# Altium schematic sheet Power.SchDoc
size A4
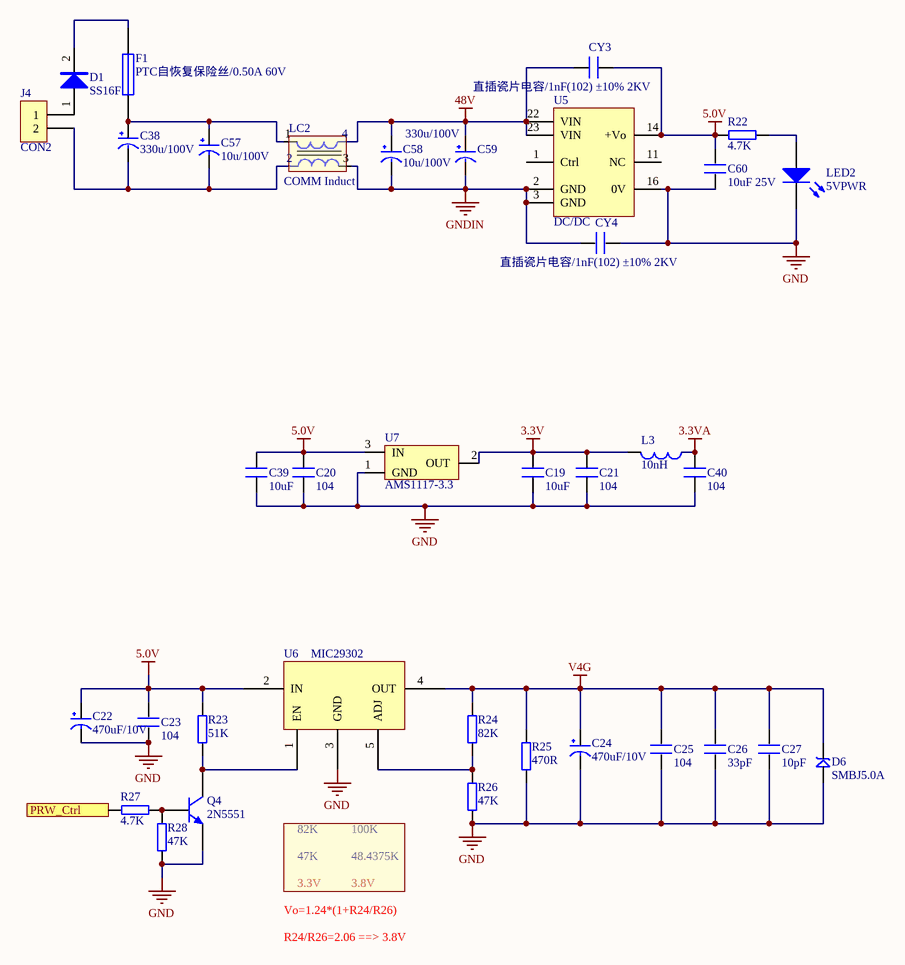
[diagram p0: Power.SchDoc]

## Parts
C19  10uF  [1206_C]
C20  104  [0603_C]
C21  104  [0603_C]
C22  470uF/10V  [SMD-CT-7343]
C23  104  [0603_C]
C24  470uF/10V  [SMD-CT-7343]
C25  104  [0603_C]
C26  33pF  [0603_C]
C27  10pF  [0603_C]
C38  330u/100V  [SMD-CT-7343]
C39  10uF  [1206_C]
C40  104  [0603_C]
C57  10u/100V  [SMD-CT-7343]
C58  10u/100V  [SMD-CT-7343]
C59  330u/100V  [SMD-CT-7343]
C60  10uF 25V  [1206_C]
CY3  直插瓷片电容/1nF(102) ±10% 2KV  [1206_C]
CY4  直插瓷片电容/1nF(102) ±10% 2KV  [1206_C]
D1  SS16F  [SMB(DO-214AA)_S1]
D6  SMBJ5.0A  [SMB(DO-214AA)_S1]
F1  PTC自恢复保险丝/0.50A 60V  [PIN-W2/E2.8]
J4  CON2  [CON5.08-2P]
L3  10nH  [0805_L]
LC2  COMM Induct
LED2  5VPWR  [SMDLED]
Q4  2N5551  [SOT-23]
R22  4.7K  [0603_R]
R23  51K  [0603_R]
R24  82K  [0603_R]
R25  470R  [1206_R]
R26  47K  [0603_R]
R27  4.7K  [0603_R]
R28  47K  [0603_R]
U5  DC/DC
U6  MIC29302  [TO-263-5-NEW]
U7  AMS1117-3.3  [SOT-223]

## Ports
PRW_Ctrl (in)

## Nets
3.3V: C19.1 C21.1 L3.1 U7.2(OUT)
3.3VA: C40.1 L3.2
5.0V: C20.1 C22.1(VCC) C23.1 C39.2 C60.1 CY3.2 R22.2 R23.2 U5.14(+Vo) U6.2(IN) U7.3(IN)
48V: C58.1(VCC) C59.1(VCC) CY3.1 LC2.4 U5.22(VIN) U5.23(VIN)
GND: C19.2 C20.2 C21.2 C22.2(GND) C23.2 C24.2(GND) C25.2 C26.2 C27.2 C39.1 C40.2 C60.2 CY4.2 D6.1 LED2.2(K) Q4.2 R25.1 R26.1 R28.1 U5.16(0V) U6.3(GND) U7.1(GND)
GNDIN: C58.2(GND) C59.2(GND) CY4.1 LC2.3 U5.2(GND) U5.3(GND)
V4G: C24.1(VCC) C25.1 C26.1 C27.1 D6.2 R24.2 R25.2 U6.4(OUT)
PRW_Ctrl: R27.2 ; port PRW_Ctrl
NetC38_1: C38.1(VCC) C57.1(VCC) F1.1 LC2.1
NetC38_2: C38.2(GND) C57.2(GND) J4.2 LC2.2
NetD1_1: D1.1 J4.1
NetD1_2: D1.2 F1.2
NetLED2_1: LED2.1(A) R22.1
NetQ4_1: Q4.1 R27.1 R28.2
NetQ4_3: Q4.3 R23.1 U6.1(EN)
NetR24_1: R24.1 R26.2 U6.5(ADJ)

Not connected (* = marked no-connect by the designer): U5 1(Ctrl) 11(NC)

## Notes on the sheet
- 82K
- 47K
- 3.3V
- 100K
- 48.4375K
- 3.8V
- Vo=1.24*(1+R24/R26)
- R24/R26=2.06 ==> 3.8V

## Library data of the parts
C19-C21 C23 C25-C27 C39 C40 CY3 CY4 = C
C22 C24 C38 C57-C59 = CAP
C60 = C: 0805
D1 = SS34
D6 = SMBJ: TVS
F1 = Fuse 1: Fuse; Published: 8-Jun-2000; LatestRevisionDate: 17-Jul-2002; LatestRevisionNote: Re-released for DXP Platform.; PackageReference: PIN-W2/E2.8; Publisher: Altium Limited; PackageDescription: Thru-Hole; 2 Leads
L3 = L
LC2 = FL2D-Z5-103
LED2 = LED2: Typical RED, GREEN, YELLOW, AMBER GaAs LED; Published: 8-Jun-2000; LatestRevisionDate: 17-Jul-2002; LatestRevisionNote: Re-released for DXP Platform.; PackageDocument: Feb-2002; PackageReference: 3.2X1.6X1.1; Publisher: Altium Limited
Q4 = NPN
R22-R28 = RES
U5 = VRB4805ZP-10WR3
U6 = MIC29302WU
U7 = AMS1117